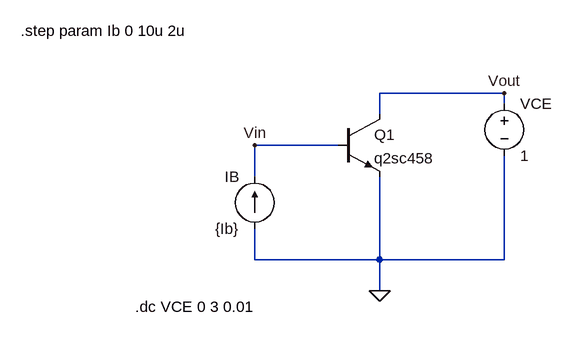
[diagram p0: schematic bjt-lab.asc]
bjt-lab.asc, the LTspice schematic file:
Version 4
SHEET 1 880 680
WIRE 480 16 288 16
WIRE 480 32 480 16
WIRE 288 48 288 16
WIRE 224 96 96 96
WIRE 96 144 96 96
WIRE 96 272 96 224
WIRE 288 272 288 144
WIRE 288 272 96 272
WIRE 480 272 480 112
WIRE 480 272 288 272
WIRE 288 320 288 272
FLAG 288 320 0
FLAG 96 96 Vin
FLAG 480 16 Vout
SYMBOL current 96 224 R180
WINDOW 0 24 80 Left 2
WINDOW 3 24 0 Left 2
WINDOW 123 0 0 Left 0
WINDOW 39 0 0 Left 0
SYMATTR InstName IB
SYMATTR Value {Ib}
SYMBOL npn 224 48 R0
SYMATTR InstName Q1
SYMATTR Value q2sc458
SYMBOL voltage 480 16 R0
WINDOW 123 0 0 Left 0
WINDOW 39 0 0 Left 0
SYMATTR InstName VCE
SYMATTR Value 1
TEXT -88 344 Left 2 !.dc VCE 0 3 0.01
TEXT -264 -80 Left 2 !.step param Ib 0 10u 2u

The netlist it stands for:
* bjt-lab.asc
IB 0 Vin {Ib}
Q1 Vout Vin 0 0 q2sc458
VCE Vout 0 1
.model NPN NPN
.model PNP PNP
.lib standard.bjt
.dc VCE 0 3 0.01
.step param Ib 0 10u 2u
.backanno
.end

* Results of the author's LTspice run, read from the files saved beside the schematic
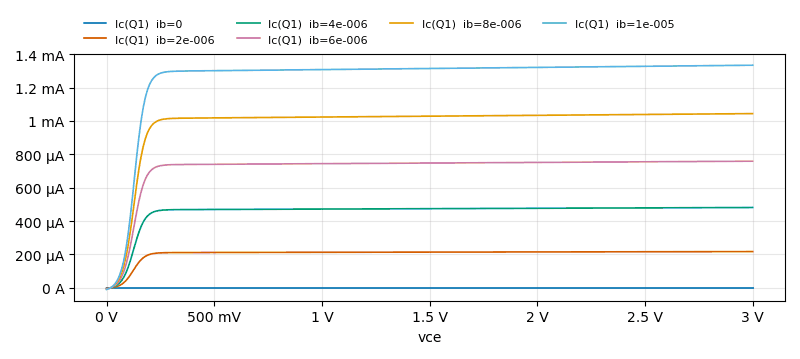
[diagram p1: DC transfer characteristic of bjt-lab.asc, plotted from the saved traces]
* DC transfer characteristic, 6 runs:
*   Ic(Q1) [ib=0]: 0 A at vce=0 V, 3.539 pA at vce=3 V, min 0 A, max 3.539 pA
*   Ic(Q1) [ib=2e-006]: -1.949 µA at vce=0 V, 217.4 µA at vce=3 V, min -1.949 µA, max 217.4 µA
*   Ic(Q1) [ib=4e-006]: -3.915 µA at vce=0 V, 481.6 µA at vce=3 V, min -3.915 µA, max 481.6 µA
*   Ic(Q1) [ib=6e-006]: -5.886 µA at vce=0 V, 759.1 µA at vce=3 V, min -5.886 µA, max 759.1 µA
*   Ic(Q1) [ib=8e-006]: -7.858 µA at vce=0 V, 1.044 mA at vce=3 V, min -7.858 µA, max 1.044 mA
*   Ic(Q1) [ib=1e-005]: -9.832 µA at vce=0 V, 1.334 mA at vce=3 V, min -9.832 µA, max 1.334 mA